# EAGLE design VCAMatrixTop (EAGLE 7.5.0)
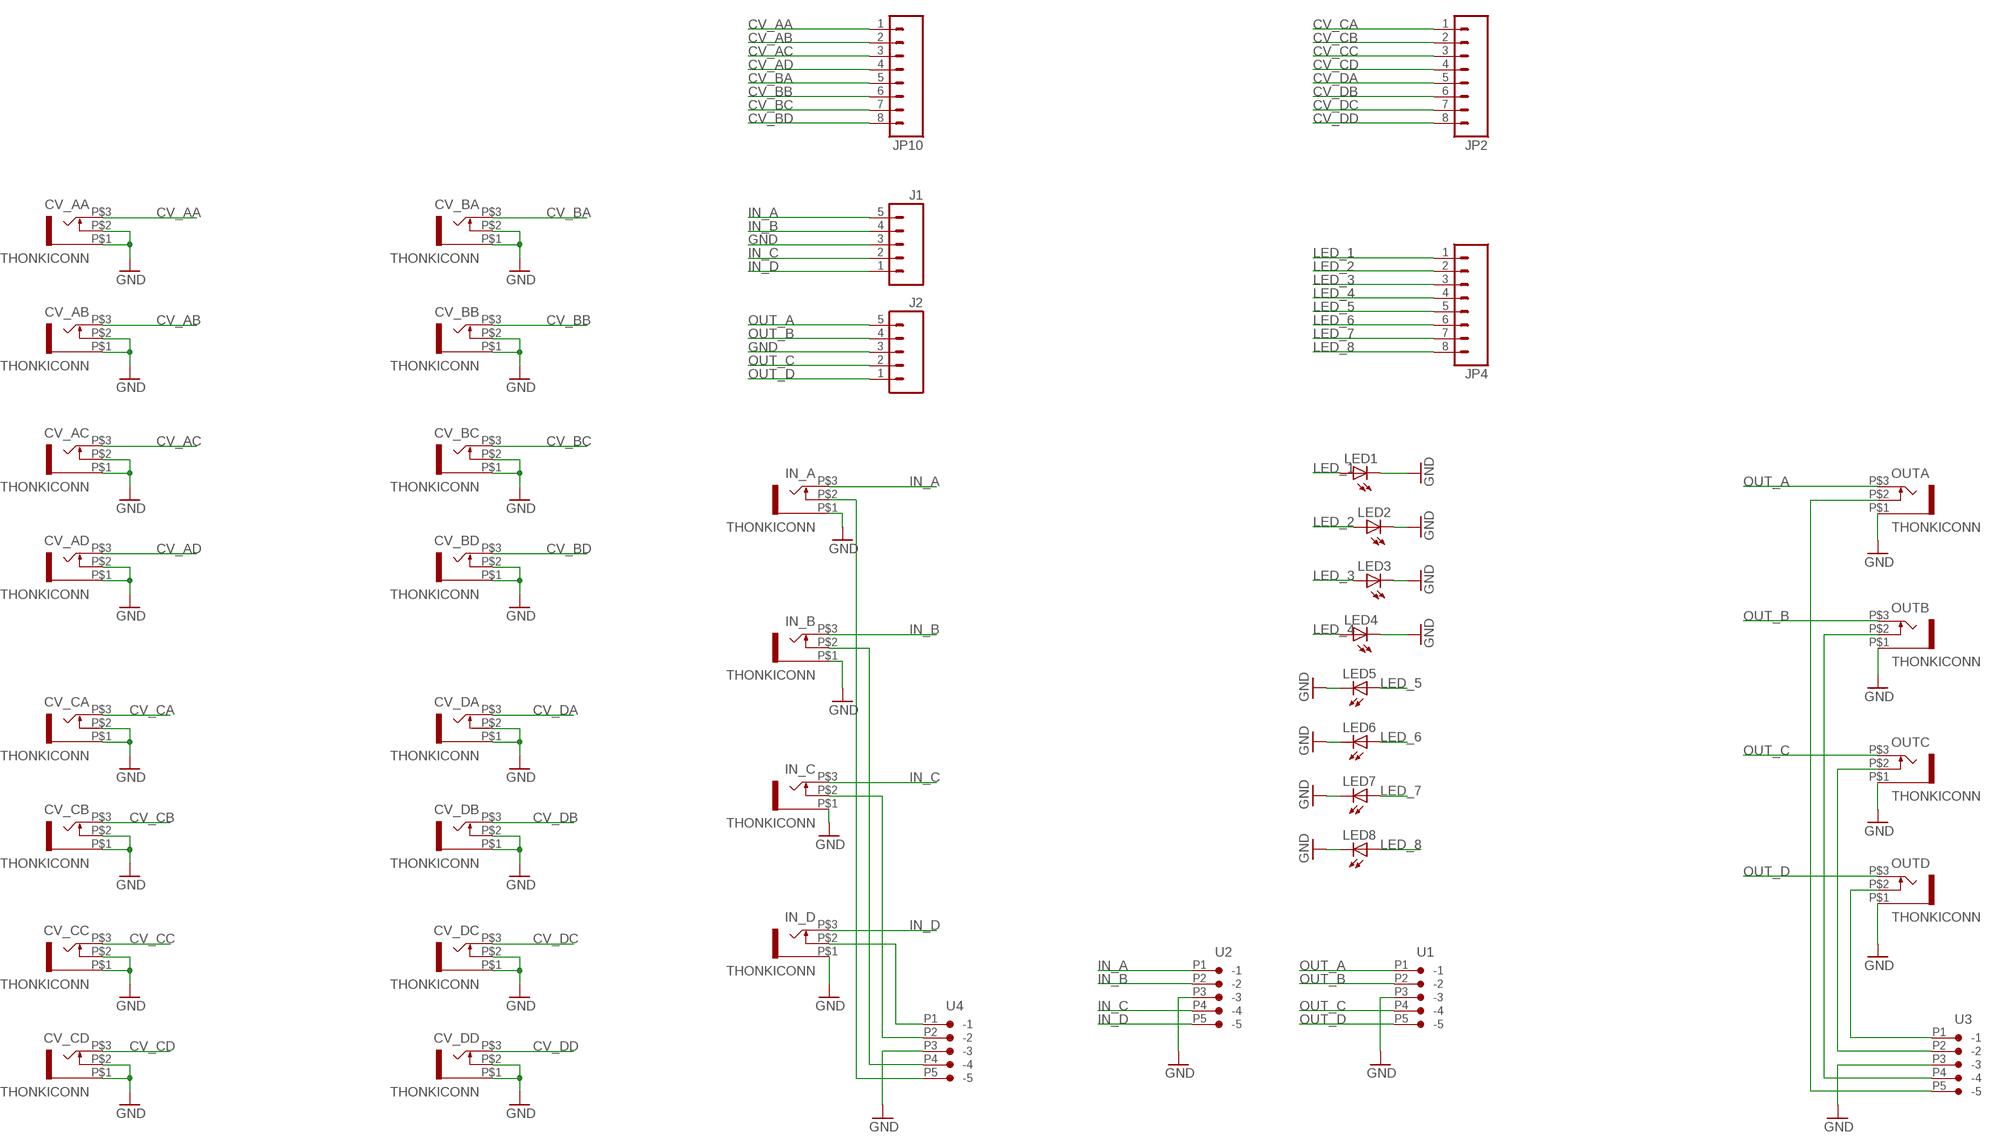
[diagram p0: schematic, sheet 1]

## Parts
CV_AA  THONKICONN  [THONKICONN]
CV_AB  THONKICONN  [THONKICONN]
CV_AC  THONKICONN  [THONKICONN]
CV_AD  THONKICONN  [THONKICONN]
CV_BA  THONKICONN  [THONKICONN]
CV_BB  THONKICONN  [THONKICONN]
CV_BC  THONKICONN  [THONKICONN]
CV_BD  THONKICONN  [THONKICONN]
CV_CA  THONKICONN  [THONKICONN]
CV_CB  THONKICONN  [THONKICONN]
CV_CC  THONKICONN  [THONKICONN]
CV_CD  THONKICONN  [THONKICONN]
CV_DA  THONKICONN  [THONKICONN]
CV_DB  THONKICONN  [THONKICONN]
CV_DC  THONKICONN  [THONKICONN]
CV_DD  THONKICONN  [THONKICONN]
IN_A  THONKICONN  [THONKICONN]
IN_B  THONKICONN  [THONKICONN]
IN_C  THONKICONN  [THONKICONN]
IN_D  THONKICONN  [THONKICONN]
J1  M05PTH  [1X05]
J2  M05PTH  [1X05]
JP2  M081X08  [1X08]
JP4  M081X08  [1X08]
JP10  M081X08  [1X08]
LED1  LED3MM  [LED3MM]
LED2  LED3MM  [LED3MM]
LED3  LED3MM  [LED3MM]
LED4  LED3MM  [LED3MM]
LED5  LED3MM  [LED3MM]
LED6  LED3MM  [LED3MM]
LED7  LED3MM  [LED3MM]
LED8  LED3MM  [LED3MM]
OUTA  THONKICONN  [THONKICONN]
OUTB  THONKICONN  [THONKICONN]
OUTC  THONKICONN  [THONKICONN]
OUTD  THONKICONN  [THONKICONN]
U1  CON-JST_PH_5W  [CON-JST_PH_5W]
U2  CON-JST_PH_5W  [CON-JST_PH_5W]
U3  CON-JST_PH_5W  [CON-JST_PH_5W]
U4  CON-JST_PH_5W  [CON-JST_PH_5W]

## Nets
CV_AA: CV_AA.P$3 JP10.1
CV_AB: CV_AB.P$3 JP10.2
CV_AC: CV_AC.P$3 JP10.3
CV_AD: CV_AD.P$3 JP10.4
CV_BA: CV_BA.P$3 JP10.5
CV_BB: CV_BB.P$3 JP10.6
CV_BC: CV_BC.P$3 JP10.7
CV_BD: CV_BD.P$3 JP10.8
CV_CA: CV_CA.P$3 JP2.1
CV_CB: CV_CB.P$3 JP2.2
CV_CC: CV_CC.P$3 JP2.3
CV_CD: CV_CD.P$3 JP2.4
CV_DA: CV_DA.P$3 JP2.5
CV_DB: CV_DB.P$3 JP2.6
CV_DC: CV_DC.P$3 JP2.7
CV_DD: CV_DD.P$3 JP2.8
GND: CV_AA.P$1 CV_AA.P$2 CV_AB.P$1 CV_AB.P$2 CV_AC.P$1 CV_AC.P$2 CV_AD.P$1 CV_AD.P$2 CV_BA.P$1 CV_BA.P$2 CV_BB.P$1 CV_BB.P$2 CV_BC.P$1 CV_BC.P$2 CV_BD.P$1 CV_BD.P$2 CV_CA.P$1 CV_CA.P$2 CV_CB.P$1 CV_CB.P$2 CV_CC.P$1 CV_CC.P$2 CV_CD.P$1 CV_CD.P$2 CV_DA.P$1 CV_DA.P$2 CV_DB.P$1 CV_DB.P$2 CV_DC.P$1 CV_DC.P$2 CV_DD.P$1 CV_DD.P$2 IN_A.P$1 IN_B.P$1 IN_C.P$1 IN_D.P$1 J1.3 J2.3 LED1.K(C) LED2.K(C) LED3.K(C) LED4.K(C) LED5.K(C) LED6.K(C) LED7.K(C) LED8.K(C) OUTA.P$1 OUTB.P$1 OUTC.P$1 OUTD.P$1 U1.P3(-3) U2.P3(-3) U3.P3(-3) U4.P3(-3)
IN_A: IN_A.P$3 J1.5 U2.P1(-1)
IN_B: IN_B.P$3 J1.4 U2.P2(-2)
IN_C: IN_C.P$3 J1.2 U2.P4(-4)
IN_D: IN_D.P$3 J1.1 U2.P5(-5)
LED_1: JP4.1 LED1.A
LED_2: JP4.2 LED2.A
LED_3: JP4.3 LED3.A
LED_4: JP4.4 LED4.A
LED_5: JP4.5 LED5.A
LED_6: JP4.6 LED6.A
LED_7: JP4.7 LED7.A
LED_8: JP4.8 LED8.A
N$55: OUTA.P$2 U3.P5(-5)
N$70: IN_B.P$2 U4.P4(-4)
N$71: IN_C.P$2 U4.P2(-2)
N$72: IN_D.P$2 U4.P1(-1)
N$73: OUTB.P$2 U3.P4(-4)
N$74: OUTC.P$2 U3.P2(-2)
N$75: OUTD.P$2 U3.P1(-1)
N$76: IN_A.P$2 U4.P5(-5)
OUT_A: J2.5 OUTA.P$3 U1.P1(-1)
OUT_B: J2.4 OUTB.P$3 U1.P2(-2)
OUT_C: J2.2 OUTC.P$3 U1.P4(-4)
OUT_D: J2.1 OUTD.P$3 U1.P5(-5)

## Library data of the parts
CV_AA CV_AB CV_AC CV_AD CV_BA CV_BB CV_BC CV_BD CV_CA CV_CB CV_CC CV_CD CV_DA CV_DB CV_DC CV_DD IN_A IN_B IN_C IN_D OUTA OUTB OUTC OUTD = Rebel:THONKICONN
J1 J2 = SparkFun-Connectors:M05: Header 5 Standard 5-pin 0.1" header. Use with straight break away headers (SKU : PRT-00116), right angle break away headers (PRT-00553), swiss pins (PRT-00743), machine pins (PRT-00117), and female headers (PRT-00115). Molex polarized connector foot print use with SKU : PRT-08230 with associated crimp pins and housings.
JP2 JP4 JP10 = SparkFun:M08: Header 8 Standard 8-pin 0.1" header. Use with straight break away headers (SKU : PRT-00116), right angle break away headers (PRT-00553), swiss pins (PRT-00743), machine pins (PRT-00117), and female headers (PRT-00115).
LED1-LED8 = adafruit:LED: LED OSRAM: - CHIPLED LG R971, LG N971, LY N971, LG Q971, LY Q971, LO R971, LY R971 LH N974, LH R974 LS Q976, LO Q976, LY Q976 LO Q996 - Hyper CHIPLED LW Q18S LB Q993, LB Q99A, LB R99A - SideLED LS A670, LO A670, LY A670, LG A670, LP A670 LB A673, LV A673, LT A673, LW A673 LH A674 LY A675 LS A676, LA A676, LO A676, LY A676, LW A676 LS A679, LY A679, LG A679 - Hyper Micro SIDELED® LS Y876, LA Y876, LO Y876, LY Y876 LT Y87S - SmartLED LW L88C, LW L88S LB L89C, LB L89S, LG L890 LS L89K, LO L89K, LY L89K LS L896, LA L896, LO L896, LY L896 - TOPLED LS T670, LO T670, LY T670, LG T670, LP T670 LSG T670, LSP T670, LSY T670, LOP T670, LYG T670 LG T671, LOG T671, LSG T671 LB T673, LV T673, LT T673, LW T673 LH T674 LS T676, LA T676, LO T676, LY T676, LB T676, LH T676, LSB T676, LW T676 LB T67C, LV T67C, LT T67C, LS T67K, LO T67K, LY T67K, LW E67C LS E67B, LA E67B, LO E67B, LY E67B, LB E67C, LV E67C, LT E67C LW T67C LS T679, LY T679, LG T679 LS T770, LO T770, LY T770, LG T770, LP T770 LB T773, LV T773, LT T773, LW T773 LH T774 LS E675, LA E675, LY E675, LS T675 LS T776, LA T776, LO T776, LY T776, LB T776 LHGB T686 LT T68C, LB T68C - Hyper Mini TOPLED® LB M676 - Mini TOPLED Santana® LG M470 LS M47K, LO M47K, LY M47K Source: http://www.osram.convergy.de/
U1-U4 = Rebel:CON-JST_PH_5W

## Module VCA
Ports: AUDIO_IN(in) CV_A(in) CV_B(in) CV_C(in) CV_D(in) OUT_A(out) OUT_B(out) OUT_C(out) OUT_D(out) +12V(pwr) -12V(pwr) GND(pwr) OFFSET_REF(in) CLAMP_REF(io)

### Library data of the parts

## Board
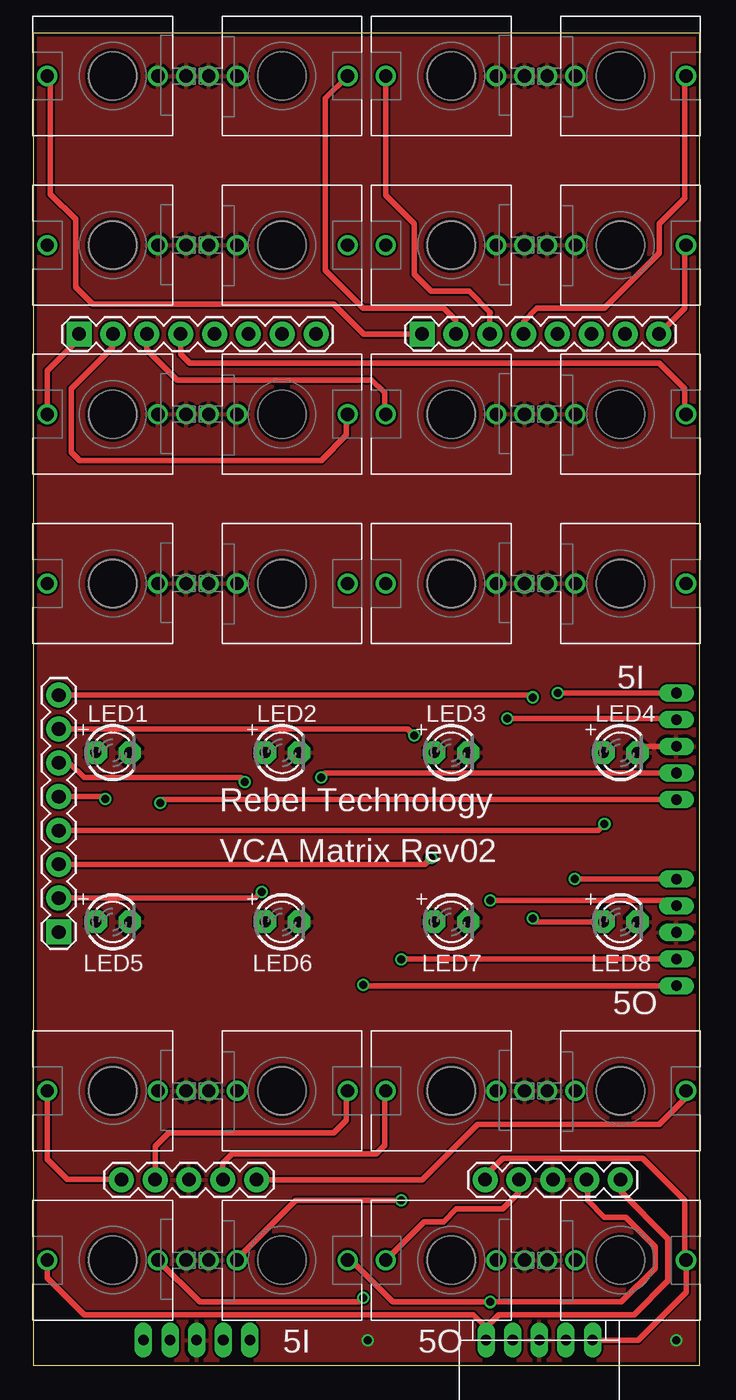
[diagram p1: board, top side]
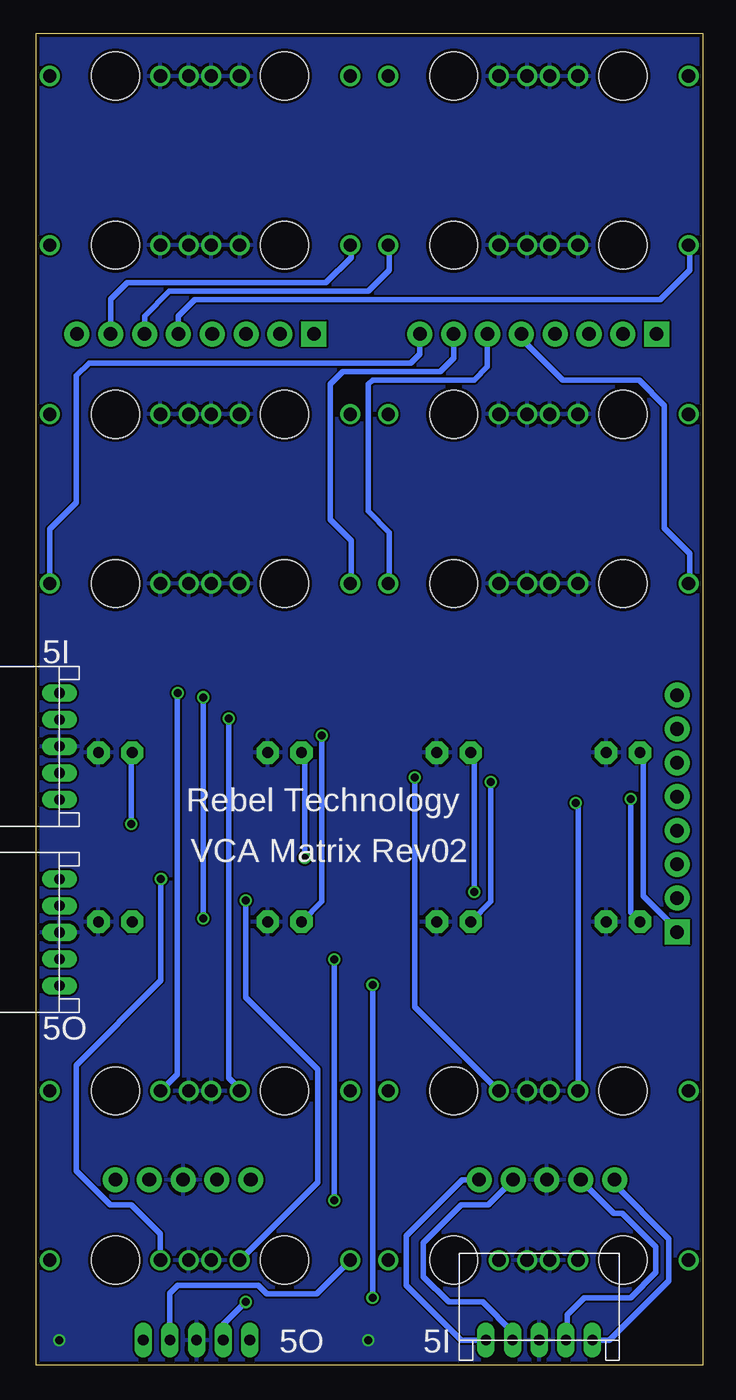
[diagram p2: board, bottom side, seen from below]

Size 50 x 100 mm. Coordinates in mm from the lower left corner, seen from the top.
Outline: 0,0 50,0 50,100 0,100 0,0
Copper layers (1*16): Top 0.035mm / dielectric 1.5mm / Bottom 0.035mm
Design rules "SeeedStudio_2layer_DRU_no_angle_20140221": minimum track width 6mil, minimum drill 12mil, track to track 6mil, track to pad 6mil, pad to pad 6mil, via to via 6mil, smd to smd 0mil, copper to edge 10mil, drill to drill 10mil, minimum pad ring 10mil, minimum via ring 6mil, stop-mask expansion 2mil, vias tented up to drill 100mil, thermal gap 10mil

### Footprints (pad centres in the part's own frame; a part is rotated, then mirrored left to right if it is on the bottom)
THONKICONN = drill 1: P$1 0,-5.5; P$2 0,-3.38; P$3 0,4.92 | hole 3.6: 0,0
1X05 = drill 1.016 pad 1.88: 1 0,0; 2 2.54,0; 3 5.08,0; 4 7.62,0; 5 10.16,0
1X08 = drill 1.016 pad 1.88 square: 1 0,0 | drill 1.016 pad 1.88: 2 2.54,0; 3 5.08,0; 4 7.62,0; 5 10.16,0; 6 12.7,0; 7 15.24,0; 8 17.78,0
LED3MM = drill 0.813 pad 1.676 octagon: A -1.27,0; K 1.27,0
CON-JST_PH_5W = drill 0.8 long: P1 0,0; P2 -2,0; P3 -4,0; P4 -6,0; P5 -8,0

### Placement (x,y rotation side)
CV_AA  5.97,96.8 90 top
CV_AB  18.67,96.8 270 top
CV_AC  31.37,96.8 90 top
CV_AD  44.07,96.8 270 top
CV_BA  5.97,84.1 90 top
CV_BB  18.67,84.1 270 top
CV_BC  31.37,84.1 90 top
CV_BD  44.07,84.1 270 top
CV_CA  5.97,71.4 90 top
CV_CB  18.67,71.4 270 top
CV_CC  31.37,71.4 90 top
CV_CD  44.07,71.4 270 top
CV_DA  5.97,58.7 90 top
CV_DB  18.67,58.7 270 top
CV_DC  31.37,58.7 90 top
CV_DD  44.07,58.7 270 top
IN_A  5.97,20.6 90 top
IN_B  18.67,20.6 270 top
IN_C  31.37,20.6 90 top
IN_D  44.07,20.6 270 top
J1  16.76,13.93 180 top
J2  33.91,13.93 0 top
JP2  3.44,77.42 0 top
JP4  1.91,32.53 90 top
JP10  29.18,77.43 0 top
LED1  5.97,46 0 top
LED2  18.67,46 0 top
LED3  31.37,46 0 top
LED4  44.07,46 0 top
LED5  5.97,33.3 0 top
LED6  18.67,33.3 0 top
LED7  31.37,33.3 0 top
LED8  44.07,33.3 0 top
OUTA  5.97,7.9 90 top
OUTB  18.67,7.9 270 top
OUTC  31.37,7.9 90 top
OUTD  44.07,7.9 270 top
U1  33.98,1.89 180 top
U2  8.26,1.89 0 bottom
U3  48.26,36.5 90 bottom
U4  48.26,50.47 90 bottom

### Tracks (layer width: path | path; a pad name or v marks a point on that pad's centre or on a via)
CV_AA
  Top 0.406: JP10.1 24.8,77.43 22.55,79.68 4.45,79.68 3.18,80.95 3.18,86.03 1.27,87.93 1.27,96.57 CV_AA.P$3
CV_AB
  Top 0.406: JP10.2 31.72,78.45 30.8,79.36 24.77,79.36 21.91,82.22 21.91,95.12 CV_AB.P$3
CV_AC
  Top 0.406: CV_AC.P$3 26.45,87.84 28.58,85.71 28.58,81.9 29.85,80.63 32.71,80.63 34.26,79.08 | 34.26,79.08 34.29,79.04 | JP10.3 34.26,79.08
CV_AD
  Top 0.406: JP10.4 36.8,78.37 37.79,79.36 42.87,79.36 46.99,83.49 46.99,85.71 48.9,87.62 48.9,96.71 CV_AD.P$3
CV_BA
  Bottom 0.406: JP10.5 39.34,78.76 38.1,80 3.18,80 0.96,82.22 0.96,84.01 CV_BA.P$3
CV_BB
  Bottom 0.406: JP10.6 41.88,78.76 40.01,80.63 25.09,80.63 23.5,82.22 23.5,84.01 CV_BB.P$3
CV_BC
  Bottom 0.406: JP10.7 44.42,80.03 43.18,81.27 28.26,81.27 26.36,83.17 26.36,84.01 CV_BC.P$3
CV_BD
  Top 0.406: JP10.8 46.96,77.42 48.9,79.36 48.9,84.01 CV_BD.P$3
CV_CA
  Top 0.406: CV_CA.P$3 1.05,74.69 3.44,77.08 JP2.1
CV_CB
  Top 0.406: CV_CB.P$3 23.5,71.31 23.5,69.84 21.59,67.93 3.5,67.93 2.86,68.57 2.86,73.33 5.98,76.45 JP2.2
CV_CC
  Top 0.406: JP2.3 8.52,76.24 10.8,73.96 25.4,73.96 26.36,73.01 26.36,71.48 CV_CC.P$3
CV_CD
  Top 0.406: JP2.4 11.06,75.93 11.75,75.23 46.99,75.23 48.9,73.33 48.9,71.48 CV_CD.P$3
CV_DA
  Bottom 0.406: JP2.5 13.6,77.08 10.48,73.96 4.77,73.96 2.86,72.06 2.86,62.85 0.96,60.95 0.96,58.78 CV_DA.P$3
CV_DB
  Bottom 0.406: JP2.6 16.14,74.97 17.15,73.96 24.77,73.96 25.09,73.65 25.09,64.12 23.5,62.53 23.5,58.78 CV_DB.P$3
CV_DC
  Bottom 0.406: JP2.7 18.68,75.61 19.69,74.6 26.99,74.6 27.94,73.65 27.94,63.49 26.36,61.9 26.36,58.78 CV_DC.P$3
CV_DD
  Bottom 0.406: CV_DD.P$3 48.99,62.76 46.99,64.76 46.99,74.28 46.04,75.23 21.91,75.23 21.22,75.93 JP2.8
GND  (via drill 0.6)
  Top 0.406: U4.P3 45.81,46.47 LED4.K
  other vias: 25.09,1.89 48.26,1.89
  pour Top: -2.62,105.69 54.53,105.69 54.53,-4.8 -2.62,-4.8
  pour Bottom: -1.35,103.15 55.8,103.15 55.8,-7.34 -1.35,-7.34
IN_A
  Top 0.406: IN_A.P$3 1.05,15.45 2.54,13.96 6.57,13.96 J1.5
  Bottom 0.406: J1.5 6.6,13.57 2.54,9.51 2.54,6.34 6.99,1.89 U2.P1
IN_B
  Top 0.406: J1.4 9.14,16.43 10.16,17.45 22.55,17.45 23.5,18.4 23.5,20.51 IN_B.P$3
  Bottom 0.406: J1.4 9.14,13.89 6.67,11.42 6.04,11.42 3.5,8.88 3.5,6.97 5.4,5.07 8.89,5.07 10.16,3.8 10.16,1.99 U2.P2
IN_C
  Top 0.406: J1.2 14.22,15.16 14.93,15.86 25.72,15.86 26.36,16.5 26.36,20.51 IN_C.P$3
  Bottom 0.406: U2.P4 14.26,2.49 16.51,4.75 19.05,4.75 20.96,6.65 20.96,9.19 18.1,12.05 16.1,12.05 J1.2
IN_D
  Top 0.406: J1.1 29.19,13.93 33.34,18.08 46.99,18.08 48.9,19.99 48.9,20.51 IN_D.P$3
  Bottom 0.406: U2.P5 18.1,1.89 22.23,6.02 22.23,9.73 18.03,13.93 J1.1
LED_1
  Top 0.406: JP4.1
  Bottom 0.406: JP4.1 1.91,32.69 4.45,35.23 4.45,45.75 LED1.A
LED_2  (via drill 0.6)
  Top 0.406: JP4.2 16.67,35.07 v17.15,35.55
  Bottom 0.406: v17.15,35.55 17.15,45.75 LED2.A
LED_3  (via drill 0.6)
  Top 0.406: JP4.3 29.37,37.61 v29.85,38.09
  Bottom 0.406: v29.85,38.09 29.85,45.75 LED3.A
LED_4  (via drill 0.6)
  Top 0.406: JP4.4 42.39,40.15 v42.87,40.63
  Bottom 0.406: v42.87,40.63 42.87,45.92 LED4.A
LED_5  (via drill 0.6)
  Top 0.406: JP4.5 5.24,42.69 v5.4,42.53
  Bottom 0.406: v5.4,42.53 5.4,34 LED5.A
LED_6  (via drill 0.6)
  Top 0.406: JP4.6 2.7,45.23 3.81,44.12 15.56,44.12 v15.88,43.8
  Bottom 0.406: v15.88,43.8 15.88,34.81 LED6.A
LED_7  (via drill 0.6)
  Top 0.406: JP4.7 28.1,47.77 v28.58,47.29
  Bottom 0.406: v28.58,47.29 28.58,34.81 LED7.A
LED_8  (via drill 0.6)
  Top 0.406: JP4.8 37.31,50.31 v37.47,50.15 | LED8.A 37.72,33.29 v37.47,33.54
  Bottom 0.406: v37.47,50.15 v37.47,33.54
N$55  (via drill 0.6)
  Top 0.305: 24.83,28.5 v24.77,28.56
  Top 0.406: v24.77,5.07 24.45,4.75 12.49,4.75 OUTA.P$2 | U3.P5 24.83,28.5
  Bottom 0.406: v24.77,28.56 v24.77,5.07
N$70  (via drill 0.6)
  Top 0.406: U4.P4 21.94,44.47 v21.59,44.12
  Bottom 0.406: v21.59,44.12 21.59,26.9 IN_B.P$2
N$71  (via drill 0.6)
  Top 0.406: v35.56,48.56 48.17,48.56 U4.P2
  Bottom 0.406: IN_C.P$2 34.75,20.76 35.56,21.58 v35.56,48.56
N$72  (via drill 0.6)
  Top 0.406: v39.37,50.47 U4.P1
  Bottom 0.406: IN_D.P$2 40.33,20.94 39.42,21.85 39.42,50.43 v39.37,50.47
N$73  (via drill 0.6)
  Top 0.406: OUTB.P$2 15.29,7.97 19.69,12.37 v27.63,12.37 | U3.P4 27.66,30.5 v27.63,30.47
  Bottom 0.406: v27.63,12.37 v27.63,30.47
N$74  (via drill 0.6)
  Top 0.406: v34.29,34.91 47.85,34.91 U3.P2
  Bottom 0.406: OUTC.P$2 28.9,13.74 28.9,22.21 34.29,27.61 v34.29,34.91
N$75  (via drill 0.6)
  Top 0.406: v40.64,36.5 U3.P1
  Bottom 0.406: OUTD.P$2 40.69,9.87 42.87,12.05 44.45,12.05 46.99,14.59 46.99,22.53 40.64,28.88 v40.64,36.5
N$76  (via drill 0.6)
  Top 0.406: U4.P5 9.78,42.47 v9.53,42.21
  Bottom 0.406: IN_A.P$2 9.35,42.03 v9.53,42.21
OUT_A
  Top 0.406: OUTA.P$3 1.05,6.56 3.81,3.8 33.02,3.8 33.98,2.84 | J2.5 44.14,13.86 44.14,13 47.63,9.51 47.63,6.34 45.09,3.8 34.93,3.8 33.98,2.84 | 33.98,2.84 U1.P1
OUT_B  (via drill 0.6)
  Top 0.406: J2.4 41.6,13.86 41.6,12.37 42.87,11.1 44.45,11.1 46.68,8.88 46.68,7.29 44.14,4.75 v34.29,4.75 26.99,4.75 23.85,7.89 OUTB.P$3
  Bottom 0.406: U1.P2 35.98,3.07 v34.29,4.75
OUT_C
  Top 0.406: J2.2 36.45,12.93 35.25,11.73 31.75,11.73 30.8,10.78 29.33,10.78 OUTC.P$3
  Bottom 0.406: U1.P4 39.98,5.42 39.37,6.02 33.34,6.02 32.71,5.38 28.96,5.38 OUTC.P$3
OUT_D
  Top 0.305: 34.01,13.93 J2.1
  Top 0.406: 34.01,13.93 34.01,14.3 35.25,15.54 45.72,15.54 48.9,12.37 48.9,7.98 OUTD.P$3 48.99,5.47 45.41,1.89 U1.P5

### Text on the board
tPlace: 5I | Rebel Technology | VCA Matrix Rev02 | 5O | 5I | 5O
bPlace: 5I | Rebel Technology | VCA Matrix Rev02 | 5O | 5I | 5O